# Altium schematic sheet sche_smarthome.SchDoc
size A
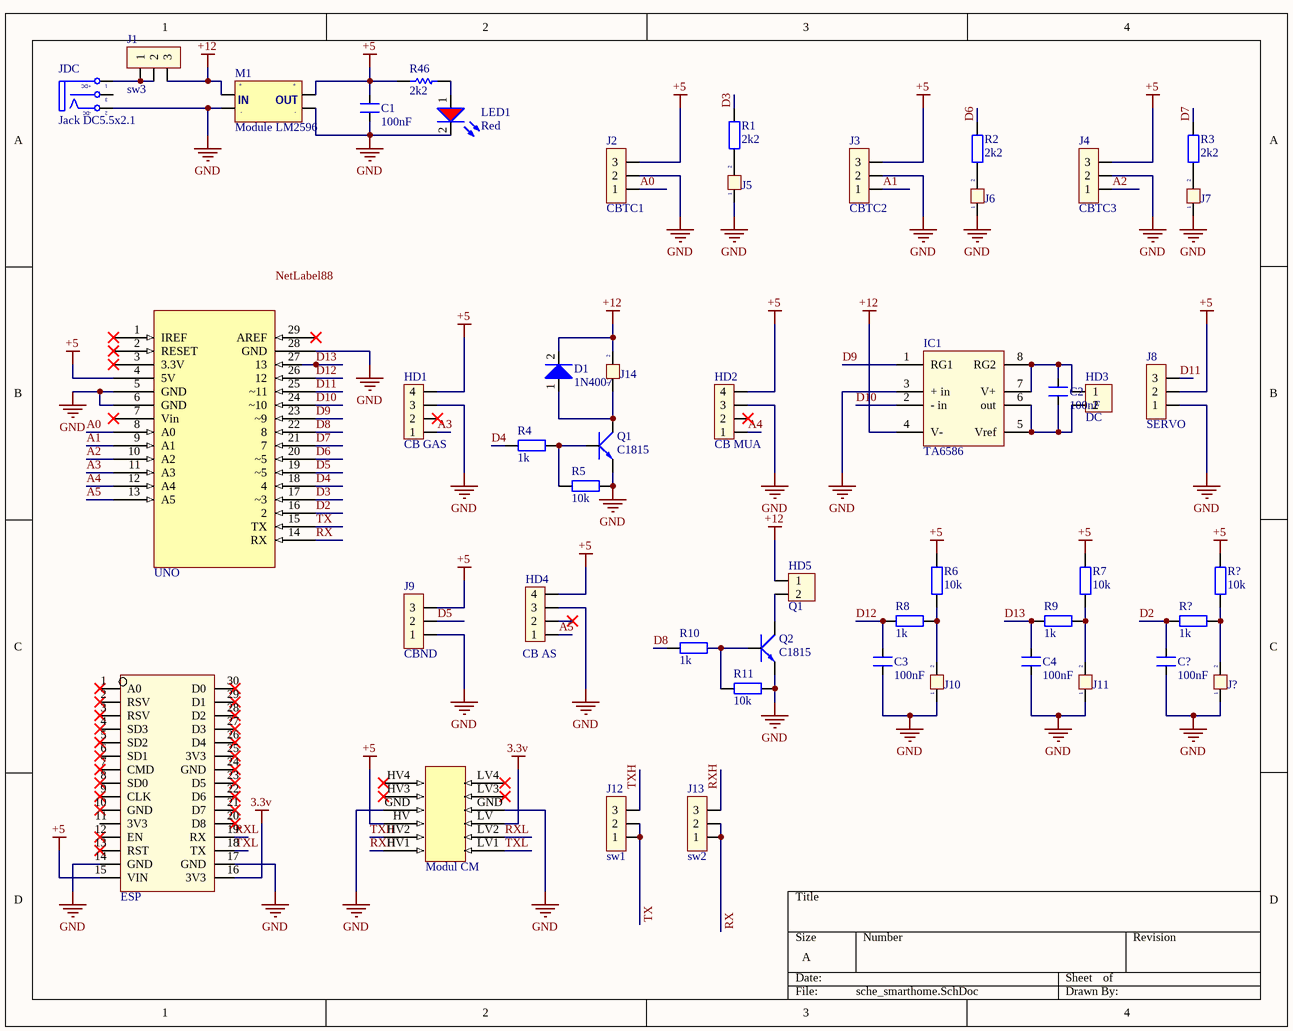
[diagram p0: sche_smarthome.SchDoc]

## Parts
(Parts that share a designator on the sheet are numbered #1, #2 ... from top to bottom, then left to right.)
C1  100nF  [CN3]
C2  100nF  [CN3]
C3  100nF  [CN3]
C4  100nF  [CN3]
C?  100nF  [CN3]
D1  1N4007  [1N4007]
ESP  ESP8266  [ESP8266]  (value not drawn)
HD1  CB GAS  [Header_4]
HD2  CB MUA  [Header_4]
HD3  DC  [HED2]
HD4  CB AS  [Header_4]
HD5  Q1  [HED2]
IC1  TA6586  [DIP8/W0.3]
J1  sw3  [JP3]
J2  CBTC1  [JP3]
J3  CBTC2  [JP3]
J4  CBTC3  [JP3]
J5  Jumper 2  [JP2]  (value not drawn)
J6  Jumper 2  [JP2]  (value not drawn)
J7  Jumper 2  [JP2]  (value not drawn)
J8  SERVO  [JP3]
J9  CBND  [JP3]
J10  Jumper 2  [JP2]  (value not drawn)
J11  Jumper 2  [JP2]  (value not drawn)
J12  sw1  [JP3]
J13  sw2  [JP3]
J14  Jumper 2  [JP2]  (value not drawn)
J?  Jumper 2  [JP2]  (value not drawn)
JDC  Jack DC5.5x2.1  [DC-IN]
LED1  value Red  [LED3R]  (hidden comment: LT0668)
M1  Module LM2596  [MODULE LM2596 MINI]
Modul_CM  chuyen muc logic  [chuyen muc logic]  (value not drawn)
Q1  C1815  [QTO-92]
Q2  C1815  [QTO-92]
R1  2k2  [R1/4W]
R2  2k2  [R1/4W]
R3  2k2  [R1/4W]
R4  1k  [R1/4W]
R5  10k  [R1/4W]
R6  10k  [R1/4W]
R7  10k  [R1/4W]
R8  1k  [R1/4W]
R9  1k  [R1/4W]
R10  1k  [R1/4W]
R11  10k  [R1/4W]
R46  value 2k2  [R1/4W]  (hidden comment: Res1)
R?#1  10k  [R1/4W]
R?#2  1k  [R1/4W]
UNO  Ahihi  [PCBComponent_1]  (value not drawn)

## Nets
3.3v: ESP.16(3V3) Modul_CM.LV
+5: C1.2 ESP.15(VIN) HD1.4 HD2.4 HD4.4 J2.3 J3.3 J4.3 J8.2 J9.3 M1.3 Modul_CM.HV R6.2 R7.2 R46.2 R?#1.2 UNO.4(5V)
+12: D1.2(K) HD5.1 IC1.4(V-) J1.3 J14.2 M1.1
GND: C1.1 C3.1 C4.1 C?.1 ESP.14(GND) ESP.17(GND) HD1.3 HD2.3 HD4.3 IC1.3(+_in) J2.2 J3.2 J4.2 J5.1 J6.1 J7.1 J8.1 J9.1 J10.1 J11.1 J?.1 JDC.2(TN) LED1.2(K) M1.2 M1.4 Modul_CM.GND Q1.1(E) Q2.1(E) R5.2 R11.2 UNO.5(GND) UNO.6(GND) UNO.28(GND)
A0: J2.1 UNO.8(A0)
A1: J3.1 UNO.9(A1)
A2: J4.1 UNO.10(A2)
A3: HD1.1 UNO.11(A3)
A4: HD2.1 UNO.12(A4)
A5: HD4.1 UNO.13(A5)
D2: C?.2 R?#2.1 UNO.16(2)
D3: R1.2 UNO.17(~3)
D4: R4.1 UNO.18(4)
D5: J9.2 UNO.19(~5)
D6: R2.2 UNO.20(~5)
D7: R3.2 UNO.21(7)
D8: R10.1 UNO.22(8)
D9: IC1.1(RG1) UNO.23(~9)
D10: IC1.2(-_in) UNO.24(~10)
D11: J8.3 UNO.25(~11)
D12: C3.2 R8.1 UNO.26(12)
D13: C4.2 R9.1 UNO.27(13)
RX: J13.1 J13.2 UNO.14(RX)
RXH: J13.3 Modul_CM.HV1
RXL: ESP.19(RX) Modul_CM.LV2
TX: J12.1 J12.2 UNO.15(TX)
TXH: J12.3 Modul_CM.HV2
TXL: ESP.18(TX) Modul_CM.LV1
NetC2_1: C2.1 HD3.2 IC1.5(Vref) IC1.6(out)
NetC2_2: C2.2 HD3.1 IC1.7(V+) IC1.8(RG2)
NetD1_1: D1.1(A) J14.1 Q1.2(C)
NetHD5_2: HD5.2 Q2.2(C)
NetJ1_1: J1.1 J1.2 JDC.1(T)
NetJ5_2: J5.2 R1.1
NetJ6_2: J6.2 R2.1
NetJ7_2: J7.2 R3.1
NetJ10_2: J10.2 R6.1 R8.2
NetJ11_2: J11.2 R7.1 R9.2
NetJ?_2: J?.2 R?#1.1 R?#2.2
NetLED1_1: LED1.1(A) R46.1
NetQ1_3: Q1.3(B) R4.2 R5.1
NetQ2_3: Q2.3(B) R10.2 R11.1

Not connected (* = marked no-connect by the designer): ESP 1(A0)* 2(RSV)* 3(RSV)* 4(SD3)* 5(SD2)* 6(SD1)* 7(CMD)* 8(SD0)* 9(CLK)* 10(GND)* 11(3V3) 12(EN)* 13(RST)* 20(D8)* 21(D7)* 22(D6)* 23(D5)* 24(GND)* 25(3V3)* 26(D4)* 27(D3)* 28(D2)* 29(D1)* 30(D0)*; HD1 2*; HD2 2*; HD4 2*; JDC 3(S); Modul_CM HV3* HV4* LV3* LV4*; UNO 1(IREF)* 2(RESET)* 3(3.3V)* 7(Vin)* 29(AREF)*

## Notes on the sheet
- Labels drawn without touching a wire or pin: NetLabel88
- (in symbol Jack DC) +DC; -DC
- (in symbol Module LM2596 Mini) +; IN; OUT; -

## Library data of the parts
C1-C4 C? = CN3: Cap np W0.3; Value: 0,047uF; Copyright: VanDungEvn
D1 = 1N4007: Diode LS 1A 1000V DO-41; ComponentLink1Description: Datasheet; ComponentLink1URL: D:\Dropbox\Datasheets\Diodes and Rectifiers\Diodes\1N400X.pdf; Unit Price: 0.0072
HD1 HD2 HD4 = Header4: Header 4; Value: Header 4
HD3 HD5 = Hed2: Header 2 (Green); Value: Header 2
IC1 = INA118: Precision, Low Power  INSTRUMENTATION AMPLIFIER; Value: INA118; Designed by: VanDungEvn
J1-J4 J8 J9 J12 J13 = JP3: Jumper 3; Value: J3
J5-J7 J10 J11 J14 J? = JP 2: Value: JP 2
JDC = Jack DC: Cắm; Ten_Linh_Kien: Jack DC5.5x2.1MM DC5501; Ma_Hang: MH000923; Don_Vi: Con; Kieu_Chan: *; Ghi_Chu: *; Chung_Loai: Cắm
LED1 = LT0668: LED Red 2mA 2.0V 3mm; ComponentLink1Description: Datasheet; ComponentLink1URL: D:\Dropbox\Datasheets\Opto and Illumination\LEDs\LT0668.pdf; Unit Price: 0.0067
M1 = Module LM2596 Mini
Q1 Q2 = C1815: NPN 600mW, ECB; Value: C1815
R1-R11 R?#1 R?#2 = R1/4W: Resistor 1/4W; Value: R1/4W - 1K
R46 = Res1_4: Resistor; Manufacturer: Generic Components; Class: Passive; Published: 08/06/2000; Publisher: Altium Hobart Technology Centre; SubClass: Resistor